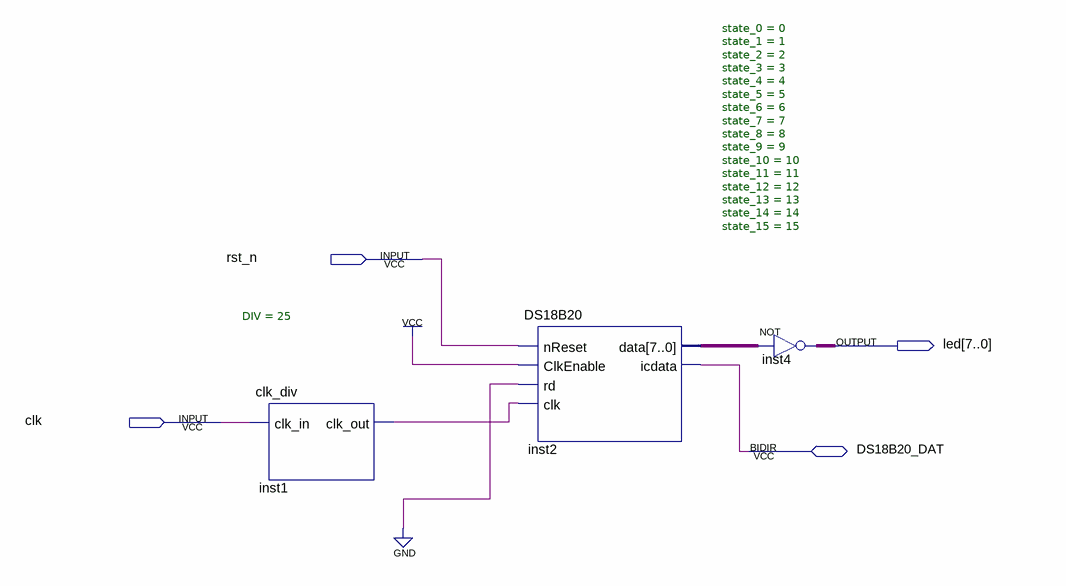
[diagram p0: schematic sheet]
// Quartus schematic top.bdf as structural Verilog: 3 symbols, 4 pins
module top (
  input  rst_n,
  input  clk,
  inout  DS18B20_DAT,
  output [7:0] led
);

  wire inst1_clk_out;
  wire [7:0] inst2_data;

  clk_div #(.DIV(25)) inst1 (.clk_in(clk), .clk_out(inst1_clk_out));
  DS18B20 #(.state_0(0), .state_1(1), .state_2(2), .state_3(3), .state_4(4), .state_5(5), .state_6(6), .state_7(7), .state_8(8), .state_9(9), .state_10(10), .state_11(11), .state_12(12), .state_13(13), .state_14(14), .state_15(15)) inst2 (
    .nReset(rst_n), .ClkEnable(1'b1), .rd(1'b0), .clk(inst1_clk_out), .data(inst2_data), .icdata(DS18B20_DAT));
  assign led = ~inst2_data;  // NOT inst4, 8 bits wide
endmodule
